# Altium schematic sheet MiniToyRobot.SchDoc
size A4
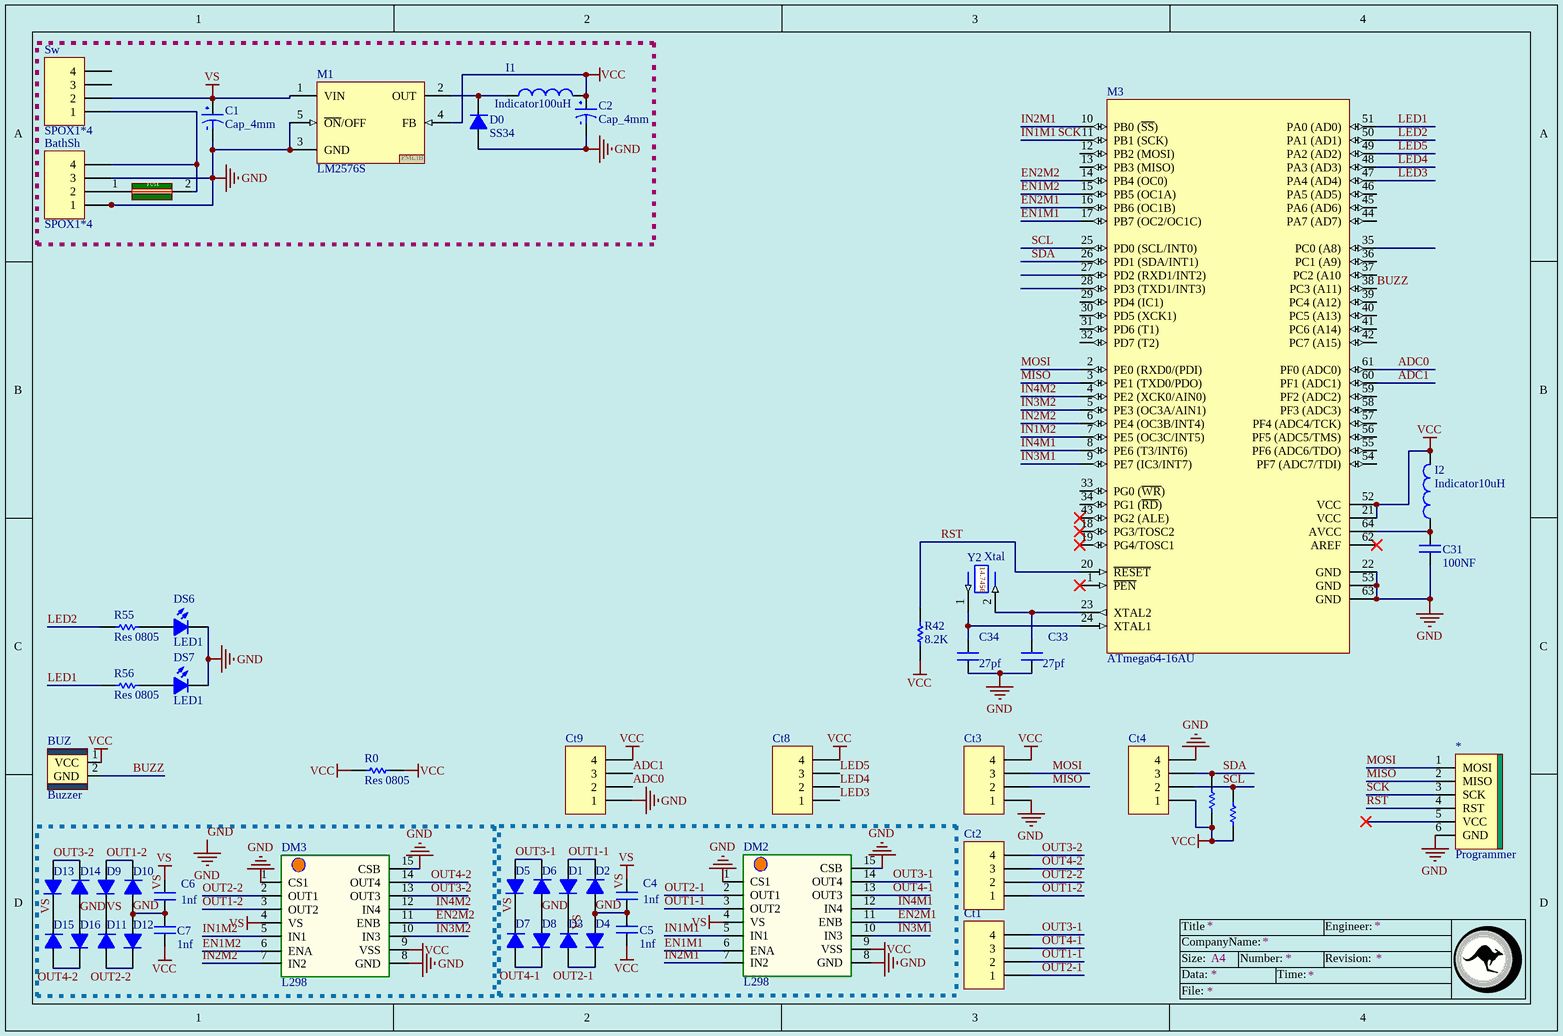
[diagram p0: MiniToyRobot.SchDoc]

## Parts
*  Programmer  [Programmer]
BathSh  SPOX1*4  [SPOX_1*4RIGHT]
BUZ  Buzzer  [Buzzer]
C1  Cap_4mm  [Cap_4mm]
C2  Cap_4mm  [Cap_4mm]
C4  1nf  [Cap0805]
C5  1nf  [Cap0805]
C6  1nf  [Cap0805]
C7  1nf  [Cap0805]
C31  100NF  [Cap0805]
C33  27pf  [Cap0805]
C34  27pf  [Cap0805]
Ct1  SPOX1*4  [SPOX_1*4RIGHT]  (value not drawn)
Ct2  SPOX1*4  [SPOX_1*4RIGHT]  (value not drawn)
Ct3  SPOX1*4  [SPOX_1*4RIGHT]  (value not drawn)
Ct4  SPOX1*4  [SPOX_1*4RIGHT]  (value not drawn)
Ct8  SPOX1*4  [SPOX_1*4RIGHT]  (value not drawn)
Ct9  SPOX1*4  [SPOX_1*4RIGHT]  (value not drawn)
D0  SS34  [Diod-1A-SMD]
D1  SS14  [Diod-1A-SMD]  (value not drawn)
D2  SS14  [Diod-1A-SMD]  (value not drawn)
D3  SS14  [Diod-1A-SMD]  (value not drawn)
D4  SS14  [Diod-1A-SMD]  (value not drawn)
D5  SS14  [Diod-1A-SMD]  (value not drawn)
D6  SS14  [Diod-1A-SMD]  (value not drawn)
D7  SS14  [Diod-1A-SMD]  (value not drawn)
D8  SS14  [Diod-1A-SMD]  (value not drawn)
D9  SS14  [Diod-1A-SMD]  (value not drawn)
D10  SS14  [Diod-1A-SMD]  (value not drawn)
D11  SS14  [Diod-1A-SMD]  (value not drawn)
D12  SS14  [Diod-1A-SMD]  (value not drawn)
D13  SS14  [Diod-1A-SMD]  (value not drawn)
D14  SS14  [Diod-1A-SMD]  (value not drawn)
D15  SS14  [Diod-1A-SMD]  (value not drawn)
D16  SS14  [Diod-1A-SMD]  (value not drawn)
DM2  L298  [L298]
DM3  L298  [L298]
DS6  LED1  [LED_SMD0805RED]
DS7  LED1  [LED_SMD0805RED]
Fuse  fuse3  [fuse_SMD0805]  (value not drawn)
I1  Indicator100uH  [Indicator_SMD]
I2  Indicator10uH  [1206]
M1  LM2576S  [LM2576S]
M3  ATmega64-16AU  [64A_N]
R0  Res 0805  [1206]
R42  8.2K  [R0805]
R55  Res 0805  [R0805]
R56  Res 0805  [R0805]
RD1  Res 0805  [R0805]  (value not drawn)
RD2  Res 0805  [R0805]  (value not drawn)
Sw  SPOX1*4  [SPOX_1*4RIGHT]
Y2  Xtal  [Crystal]

## Nets
GND: *.6(GND) BathSh.1 BathSh.3 C1.1 C2.1 C4.1 C5.2 C6.1 C7.2 C31.1 C33.1 C34.1 Ct3.1 Ct4.4 Ct9.1 D0.A D2.A D4.A D6.A D8.A D10.A D12.A D14.A D16.A DM2.1(CS1) DM2.8(GND) DM2.15(CSB) DM3.1(CS1) DM3.8(GND) DM3.15(CSB) DS6.K DS7.K M1.3(GND) M1.5(~{ON}/OFF) M3.22(GND) M3.53(GND) M3.63(GND)
VCC: BUZ.1(VCC) C2.2 C5.1 C7.1 Ct3.4 Ct4.1 Ct8.4 Ct9.4 DM2.9(VSS) DM3.9(VSS) I1.2 I2.2 M1.4(FB) M3.21(VCC) M3.52(VCC) R0.1 R0.2 R42.2 RD1.1 RD2.1
VS: C1.2 C4.2 C6.2 D1.K D3.K D5.K D7.K D9.K D11.K D13.K D15.K DM2.4(VS) DM3.4(VS) M1.1(VIN) Sw.2
ADC0: Ct9.2 M3.61(PF0_(ADC0))
ADC1: Ct9.3 M3.60(PF1_(ADC1))
BUZZ: BUZ.2(GND) M3.38(PC3_(A11))
EN1M1: DM2.6(ENA) M3.17(PB7_(OC2/OC1C))
EN1M2: DM3.6(ENA) M3.15(PB5_(OC1A))
EN2M1: DM2.11(ENB) M3.16(PB6_(OC1B))
EN2M2: DM3.11(ENB) M3.14(PB4_(OC0))
IN1M1: *.3(SCK) DM2.5(IN1) M3.11(PB1_(SCK))  [also labelled SCK]
IN1M2: DM3.5(IN1) M3.7(PE5_(OC3C/INT5))
IN2M1: DM2.7(IN2) M3.10(PB0_(~{SS}))
IN2M2: DM3.7(IN2) M3.6(PE4_(OC3B/INT4))
IN3M1: DM2.10(IN3) M3.9(PE7_(IC3/INT7))
IN3M2: DM3.10(IN3) M3.5(PE3_(OC3A/AIN1))
IN4M1: DM2.12(IN4) M3.8(PE6_(T3/INT6))
IN4M2: DM3.12(IN4) M3.4(PE2_(XCK0/AIN0))
LED1: M3.51(PA0_(AD0)) R56.2
LED2: M3.50(PA1_(AD1)) R55.2
LED3: Ct8.1 M3.47(PA4_(AD4))
LED4: Ct8.2 M3.48(PA3_(AD3))
LED5: Ct8.3 M3.49(PA2_(AD2))
MISO: *.2(MISO) Ct3.2 M3.3(PE1_(TXD0/PDO))
MOSI: *.1(MOSI) Ct3.3 M3.2(PE0_(RXD0/(PDI))
OUT1-1: Ct1.2 D1.A D2.K DM2.3(OUT2)
OUT1-2: Ct2.1 D9.A D10.K DM3.3(OUT2)
OUT2-1: Ct1.1 D3.A D4.K DM2.2(OUT1)
OUT2-2: Ct2.2 D11.A D12.K DM3.2(OUT1)
OUT3-1: Ct1.4 D5.A D6.K DM2.14(OUT4)
OUT3-2: Ct2.4 D13.A D14.K DM3.13(OUT3)
OUT4-1: Ct1.3 D7.A D8.K DM2.13(OUT3)
OUT4-2: Ct2.3 D15.A D16.K DM3.14(OUT4)
RST: *.4(RST) M3.20(~{RESET}) R42.1
SCL: Ct4.2 M3.25(PD0_(SCL/INT0)) RD2.2
SDA: Ct4.3 M3.26(PD1_(SDA/INT1)) RD1.2
NetBathSh_2: BathSh.2 Fuse.1(IN)
NetBathSh_4: BathSh.4 Fuse.2(OUT) Sw.1
NetC31_2: C31.2 I2.1 M3.64(AVCC)
NetC33_2: C33.2 M3.23(XTAL2) Y2.2
NetC34_2: C34.2 M3.24(XTAL1) Y2.1
NetD0_K: D0.K I1.1 M1.2(OUT)
NetDS6_A: DS6.A R55.1
NetDS7_A: DS7.A R56.1

Not connected (* = marked no-connect by the designer): * 5(VCC)*; M3 1(~{PEN})* 12(PB2_(MOSI)) 13(PB3_(MISO)) 18(PG3/TOSC2)* 19(PG4/TOSC1)* 27(PD2_(RXD1/INT2)) 28(PD3_(TXD1/INT3)) 29(PD4_(IC1)) 30(PD5_(XCK1)) 31(PD6_(T1)) 32(PD7_(T2)) 33(PG0_(~{WR})) 34(PG1_(~{RD})) 35(PC0_(A8)) 36(PC1_(A9)) 37(PC2_(A10) 39(PC4_(A12)) 40(PC5_(A13)) 41(PC6_(A14)) 42(PC7_(A15)) 43(PG2_(ALE))* 44(PA7_(AD7)) 45(PA6_(AD6)) 46(PA5_(AD5)) 54(PF7_(ADC7/TDI)) 55(PF6_(ADC6/TDO)) 56(PF5_(ADC5/TMS)) 57(PF4_(ADC4/TCK)) 58(PF3_(ADC3)) 59(PF2_(ADC2)) 62(AREF)*; Sw 3 4

## Notes on the sheet
- Labels drawn without touching a wire or pin: VS
- Title
- Size:
- Data:
- CompanyName:
- A4
- Number:
- Time:
- Revision:
- Engineer:
- File:
- (in symbol Crystal) 14.7456
- (in symbol fuse3) FUSE
- (in symbol LM2576S) PMLIB

## Library data of the parts
C1 C2 = Cap_Pola
C4-C7 C31 C33 C34 = Cap0805: surface mount capacitor (size 805)
D0-D16 = Diode
I2 = Indicator100uH
M3 = ATmega64-16AU: 8-bit AVR Microcontroller, 4.5-5.5V, 64KB Flash, 2KB EEPROM, 4KB SRAM, 64-pin TQFP, Industrial Grade (-40°C to 85°C), Pb-Free; DatasheetVersion: revQ, Jul-2010; PackageVersion: revC, Oct-2010; PackageReference: 64A; PackageDescription: 64-Pin Plastic Thin Profile Quad Flat Pack, 14 x 14 x 1.0 mm Body, 0.8 mm Pitch (TQFP); Code_JEDEC: MS-026-AEB; ComponentLink1Description: Manufacturer URL; ComponentLink1URL: http://www.atmel.com/; ComponentLink2Description: ATmega64(L)  Datasheet; ComponentLink2URL: http://www.atmel.com/dyn/resources/prod_documents/doc2490.pdf; ComponentLink3Description: ATmega64(L) Summary; ComponentLink3URL: http://www.atmel.com/dyn/resources/prod_documents/2490S.pdf
R42 = Res 0805
Y2 = Crystal